# EasyEDA schematic SCH_Tracker_2023-05-21.json
TITLE: SIT730; REV: 1.0; Date: 2023-05-21; Sheet: 1/1; Drawn By: Greg McLennan; Company: ID: 300272193
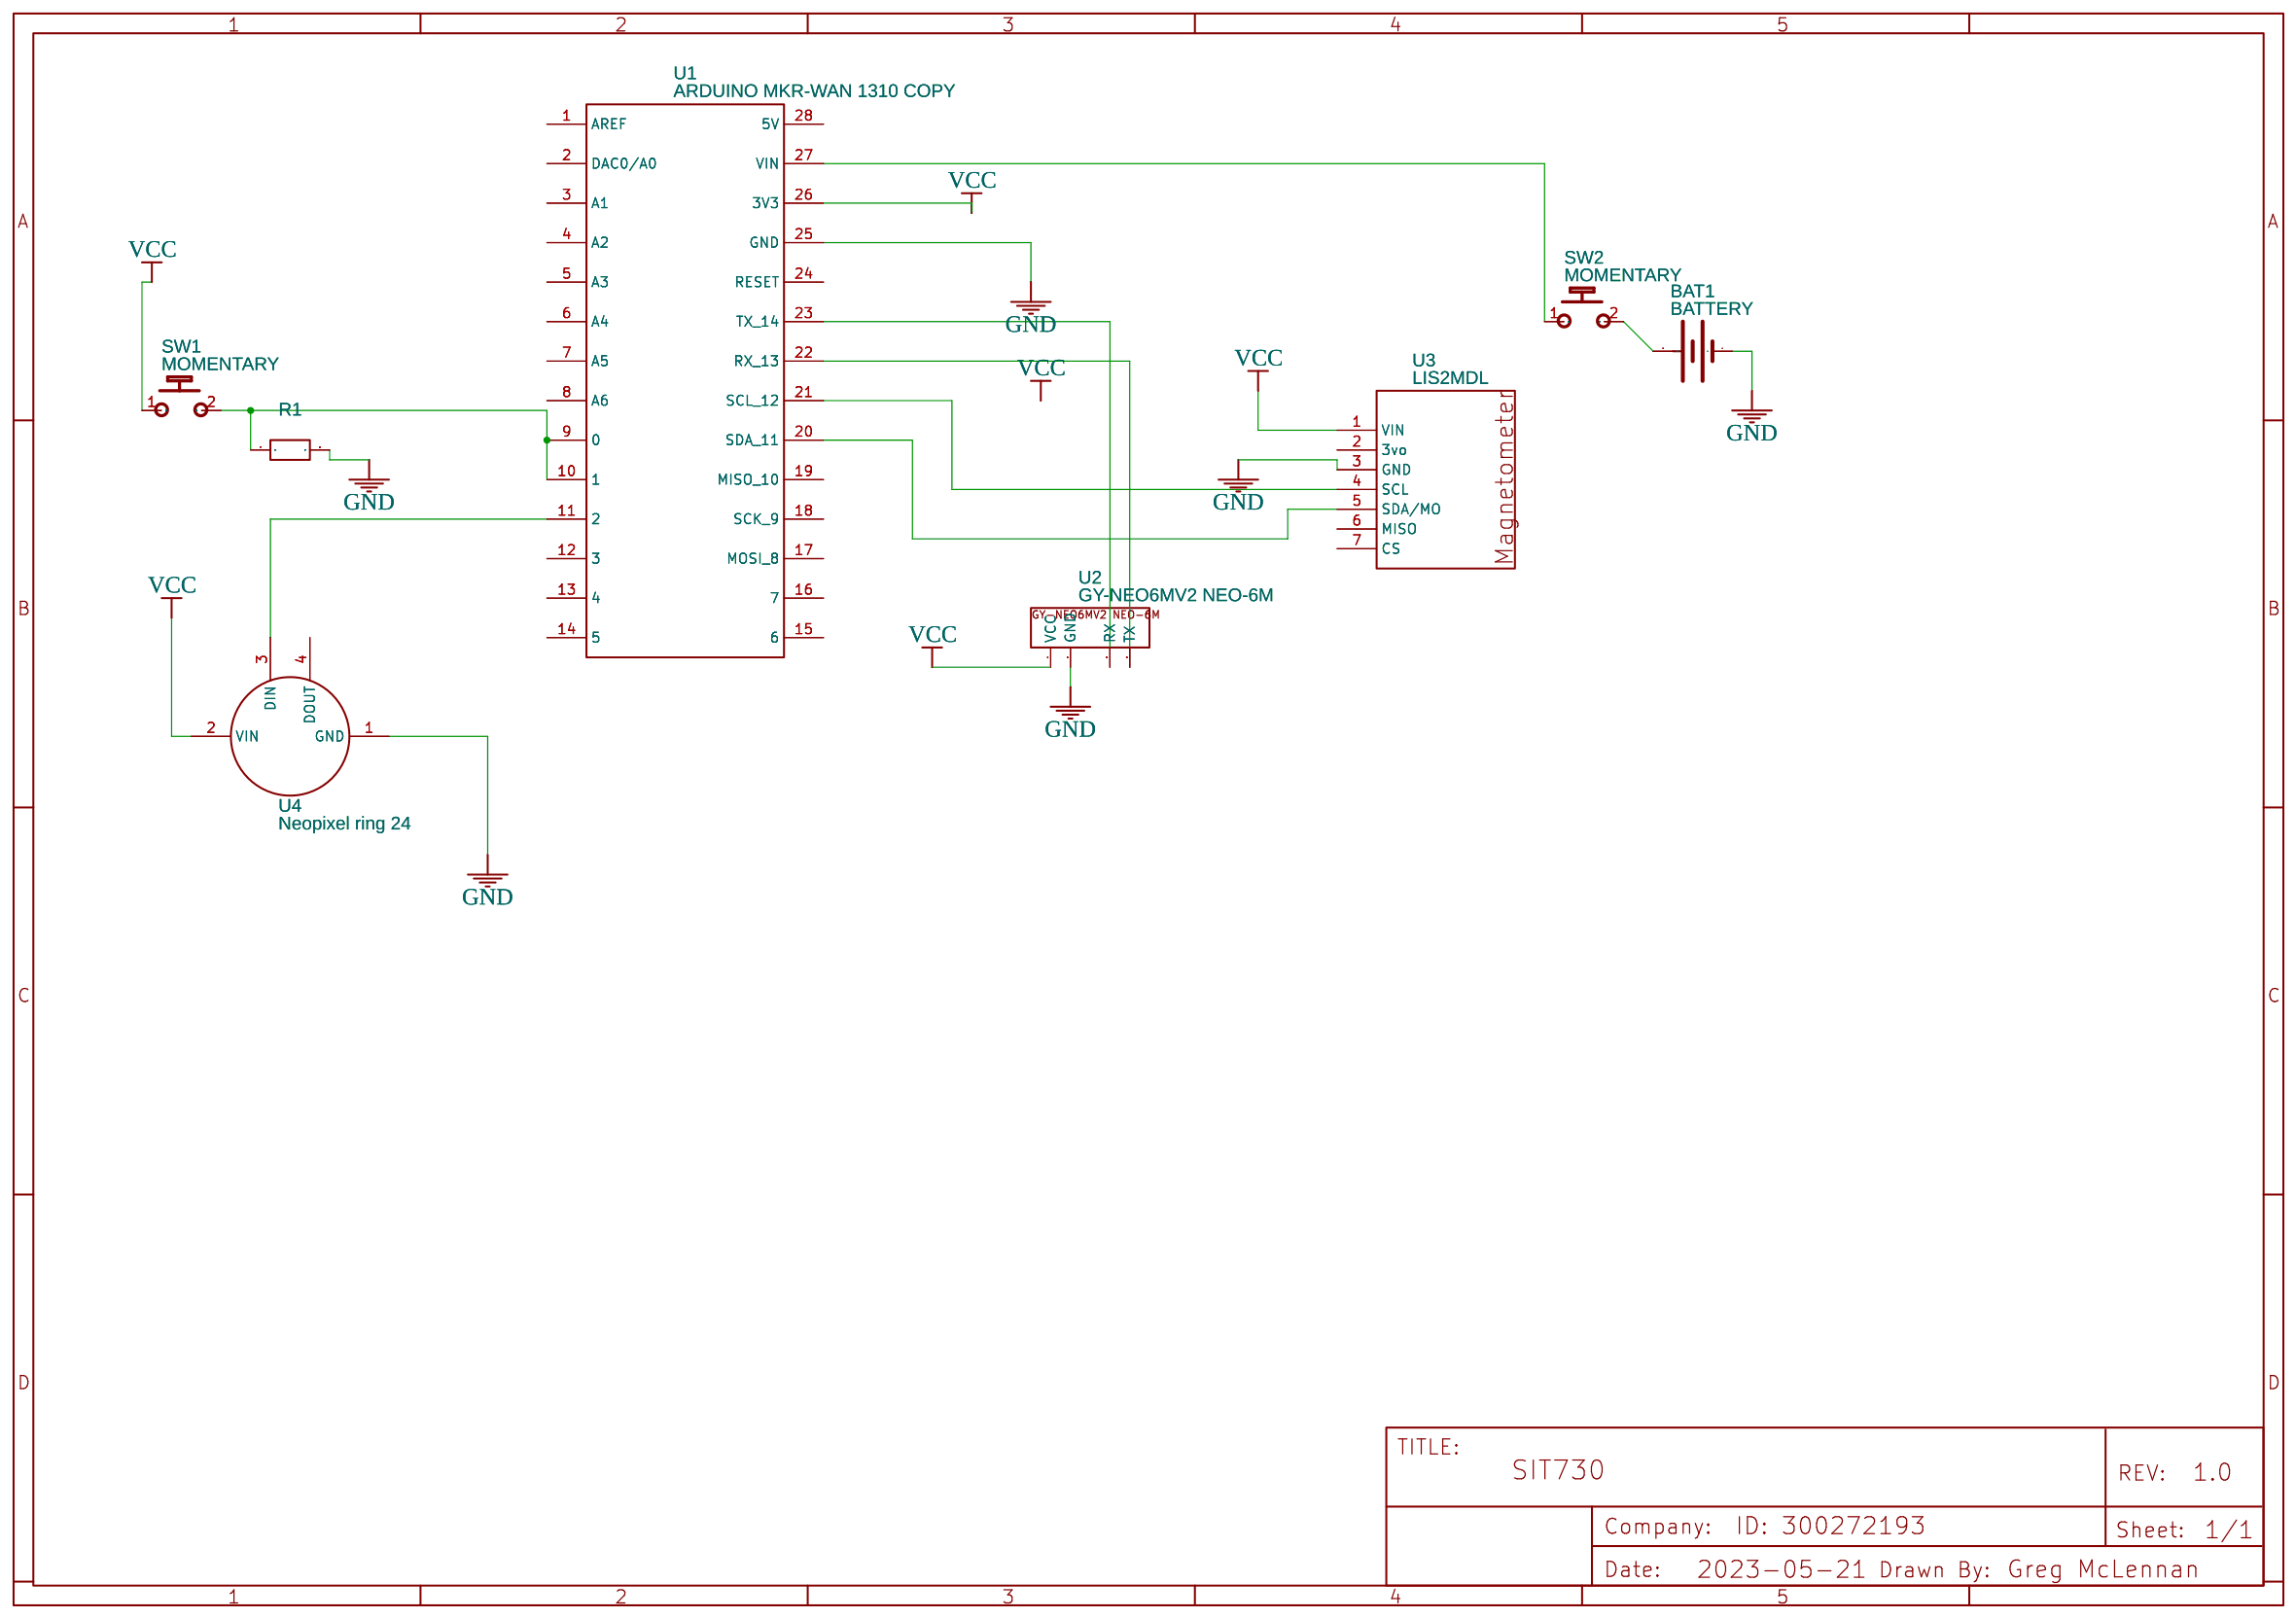
[diagram p0: schematic sheet]

## Parts
BAT1  BATTERY  [LIPO-1100MAH]
R1  贴片电阻CHIPRESISTORS  [R0603]
SW1  MOMENTARY  [SPST]
SW2  MOMENTARY  [SPST]
U1  ARDUINO MKR-WAN 1310 COPY  [ARDUINO MKR1310]
U2  GY-NEO6MV2 NEO-6M  [GY-NEO6MV2 NEO-6M]
U3  LIS2MDL  [LIS2MDL]
U4  Neopixel ring 24  [NEOPIXEL RING 16]

## Library data of the parts
BAT1 = BATTERY: Battery Holders; Contributor: SparkFun
R1 = 贴片电阻CHIPRESISTORS: Supplier: LCSC; Supplier Part: C9900014833; Manufacturer: null; Manufacturer Part: 贴片电阻ChipResistors; link: https://atta.szlcsc.comnull; JLCPCB Part Class: Extended Part; Contributor: lcsc
SW1 SW2 = MOMENTARY: Contributor: Teknologue
U1 = ARDUINO MKR-WAN 1310 COPY: Manufacturer Part: Arduino MKR GSM 1400; link: https://store.arduino.cc/mkr-wan-1310; Contributor: rafaellabastos
U2 = GY-NEO6MV2 NEO-6M: Contributor: franco.fumanti
U3 = LIS2MDL: Contributor: mikeramsey52
U4 = Neopixel ring 16: Contributor: dev.h3lgi

## Nets
GND: BAT1.- R1.2 U1.25(GND) U2.1(GND) U3.3(GND) U4.1(GND)
VCC: SW1.1(P) U1.26(3V3) U2.4(VCC) U3.1(VIN) U4.2(VIN)
Net-(BAT1-+): BAT1.+ SW2.2(S)
Net-(R1-1): R1.1 SW1.2(S) U1.9(0) U1.10(1)
Net-(SW2-1): SW2.1(P) U1.27(VIN)
Net-(U1-11): U1.11(2) U4.3(DIN)
Net-(U1-20): U1.20(SDA 11) U3.5(SDA/MO)
Net-(U1-21): U1.21(SCL 12) U3.4(SCL)
Net-(U1-22): U1.22(RX 13) U2.2(TX)
Net-(U1-23): U1.23(TX 14) U2.3(RX)

Not connected (* = marked no-connect by the designer): U1 1(AREF) 2(DAC0/A0) 3(A1) 4(A2) 5(A3) 6(A4) 7(A5) 8(A6) 12(3) 13(4) 14(5) 15(6) 16(7) 17(MOSI 8) 18(SCK 9) 19(MISO 10) 24(RESET) 28(5V); U3 2(3vo) 6(MISO) 7(CS); U4 4(DOUT)
